# Altium schematic sheet mcu_power.SchDoc
size A4
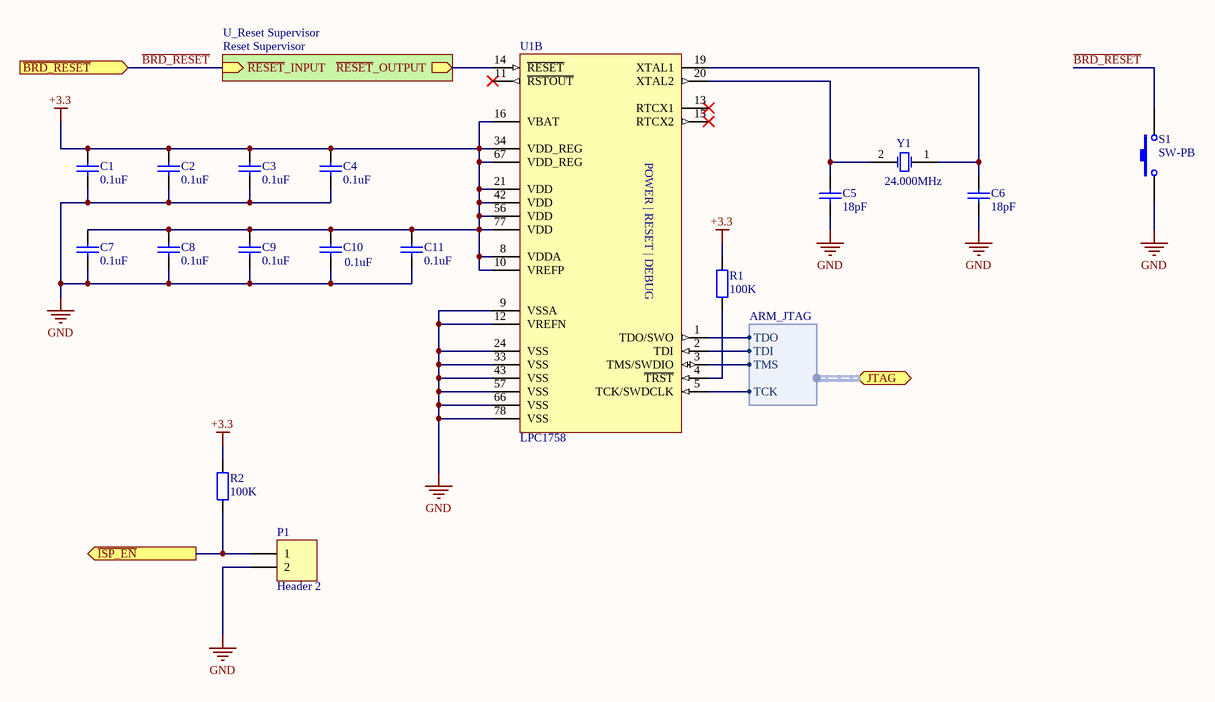
[diagram p0: mcu_power.SchDoc]

## Parts
C1  value 0.1uF  [C0603]  (hidden comment: Cap)
C2  value 0.1uF  [C0603]  (hidden comment: Cap)
C3  value 0.1uF  [C0603]  (hidden comment: Cap)
C4  value 0.1uF  [C0603]  (hidden comment: Cap)
C5  value 18pF  [C0603]  (hidden comment: Cap)
C6  value 18pF  [C0603]  (hidden comment: Cap)
C7  value 0.1uF  [C0603]  (hidden comment: Cap)
C8  value 0.1uF  [C0603]  (hidden comment: Cap)
C9  value 0.1uF  [C0603]  (hidden comment: Cap)
C10  value 0.1uF  [C0603]  (hidden comment: Cap)
C11  value 0.1uF  [C0603]  (hidden comment: Cap)
P1  Header 2  [HDR1X2]
R1  value 100K  [R0603]  (hidden comment: Res)
R2  value 100K  [R0603]  (hidden comment: Res)
S1  SW-PB  [DTSM-32S-B]
U1  LPC1758  [LPC1758FBD80]  (part B of 3)
Y1  value 24.000MHz  [C3E-24.000-12-3030-X]  (hidden comment: XTAL)

## Sub-sheets
U_Reset Supervisor = Reset Supervisor: ~{RESET}_OUTPUT (out), ~{RESET}_INPUT (in)

## Ports
JTAG (harness ARM_JTAG), ~{BRD_RESET} (in), ~{ISP_EN} (out)

## Harnesses
ARM_JTAG: TCK, TDI, TDO, TMS

## Nets
+3.3: C1.1 C2.1 C3.1 C4.1 C7.1 C8.1 C9.1 C10.1 C11.1 R1.2 R2.2 U1.8(VDDA) U1.10(VREFP) U1.16(VBAT) U1.21(VDD) U1.34(VDD_REG) U1.42(VDD) U1.56(VDD) U1.67(VDD_REG) U1.77(VDD)
GND: C1.2 C2.2 C3.2 C4.2 C5.2 C6.2 C7.2 C8.2 C9.2 C10.2 C11.2 P1.2 S1.1 U1.9(VSSA) U1.12(VREFN) U1.24(VSS) U1.33(VSS) U1.43(VSS) U1.57(VSS) U1.66(VSS) U1.78(VSS)
~{BRD_RESET}: S1.2 ; port ~{BRD_RESET}, sheet U_Reset Supervisor/~{RESET}_INPUT
~{ISP_EN}: P1.1 R2.1 ; port ~{ISP_EN}
NetC5_1: C5.1 U1.20(XTAL2) Y1.2(OSC2)
NetC6_1: C6.1 U1.19(XTAL1) Y1.1(OSC1)
NetR1_1: R1.1 U1.4(~{TRST})
NetU1_1: U1.1(TDO/SWO) ; port JTAG.TDO
NetU1_2: U1.2(TDI) ; port JTAG.TDI
NetU1_3: U1.3(TMS/SWDIO) ; port JTAG.TMS
NetU1_5: U1.5(TCK/SWDCLK) ; port JTAG.TCK
NetU1_14: U1.14(~{RESET}) ; sheet U_Reset Supervisor/~{RESET}_OUTPUT

Not connected (* = marked no-connect by the designer): U1 11(~{RSTOUT})* 13(RTCX1)* 15(RTCX2)*

## Notes on the sheet
- (in symbol LPC1758, part B) POWER | RESET | DEBUG

## Library data of the parts
C1-C11 = Cap: Capacitor
  C1-C4 C7-C11: farnell: 9406140
  C5 C6: farnell: 1759056
P1 = Header 2: Header, 2-Pin; LatestRevisionDate: 17-Jul-2002; LatestRevisionNote: Re-released for DXP Platform.; Publisher: Altium Limited
R1 R2 = Res2: Resistor; farnell: 9330402
S1 = SW-PB: Switch; Published: 24-Mar-1999; LatestRevisionDate: 17-Jul-2002; LatestRevisionNote: Re-released for DXP Platform.; PackageReference: SPST-2; Publisher: Altium Limited; farnell: 9471898
U1 = LPC1758: NXP - LPC1758FBD80 - MCU, 32BIT, ARM CORTEX M3, 80LQFP; farnell: 1718545
Y1 = XTAL: Crystal Oscillator; farnell: 1538861